# Altium schematic sheet Magnet_Encoder.SchDoc
size A4
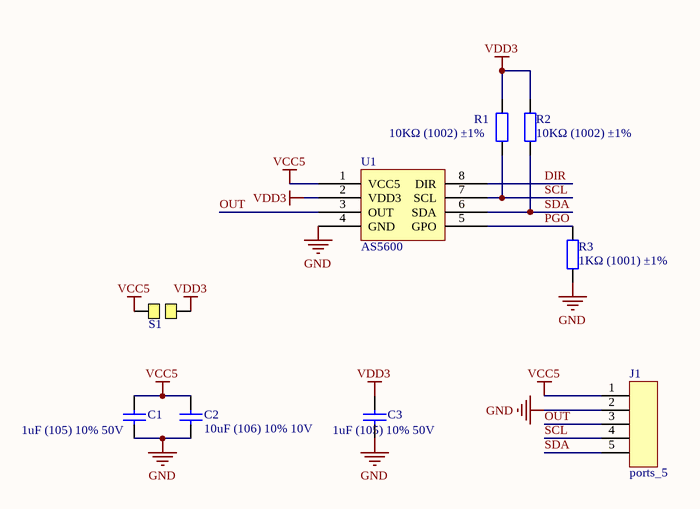
[diagram p0: Magnet_Encoder.SchDoc]

## Parts
C1  1uF (105) 10% 50V  [0603_C]
C2  10uF (106) 10% 10V  [0603_C]
C3  1uF (105) 10% 50V  [0603_C]
J1  ports_5  [GH1.25-LS-5P]
R1  10KΩ (1002) ±1%  [0603_R]
R2  10KΩ (1002) ±1%  [0603_R]
R3  1KΩ (1001) ±1%  [0603_R]
S1  SHORT-2PIN  [SHORT-2PIN]  (value not drawn)
U1  AS5600  [SOIC127P600X175-8N]

## Nets
GND: C1.1 C2.1 C3.1 J1.2 R3.1 U1.4(GND)
VCC5: C1.2 C2.2 J1.1 S1.1 U1.1(VCC5)
VDD3: C3.2 R1.2 R2.2 S1.2 U1.2(VDD3)
DIR: U1.8(DIR)
OUT: J1.3 U1.3(OUT)
PGO: R3.2 U1.5(GPO)
SCL: J1.4 R1.1 U1.7(SCL)
SDA: J1.5 R2.1 U1.6(SDA)

## Library data of the parts
C1 C3 = 0603 1uF (105) 10% 50V: 贴片电容; ComponentLink1Description: 供应商链接; ComponentLink1URL: http://www.szlcsc.com/product/details_16531.html; Package: 0603; Supplier: LC; SuppliersPartNumber: C15849
C2 = 0603 10uF (106) 10% 10V: 贴片电容; ComponentLink1Description: 供应商链接; ComponentLink1URL: http://www.szlcsc.com/product/details_20411.html; Package: 0603; Supplier: LC; SuppliersPartNumber: C19702
R1 R2 = 0603 10KΩ (1002) 1%: 贴片电阻; ComponentLink1Description: 供应商链接; ComponentLink1URL: http://www.szlcsc.com/product/details_26547.html; Package: 0603; Supplier: LC; SuppliersPartNumber: C25804
R3 = 0603 1KΩ (1001) 1%: 贴片电阻; ComponentLink1Description: 供应商链接; ComponentLink1URL: http://www.szlcsc.com/product/details_21904.html; Package: 0603; Supplier: LC; SuppliersPartNumber: C21190
U1 = AS5600: Magnet Encoder